# EAGLE design db9-can-hub01 (EAGLE 7.3.0)
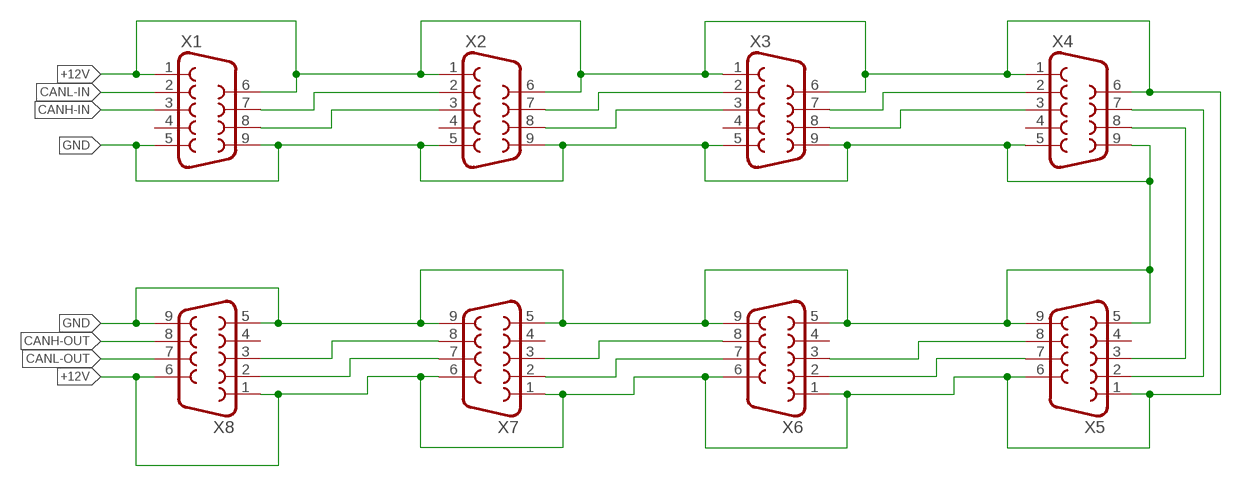
[diagram p0: schematic, sheet 1]

## Parts
X1  F09H  [F09H]
X2  F09H  [F09H]
X3  F09H  [F09H]
X4  F09H  [F09H]
X5  F09H  [F09H]
X6  F09H  [F09H]
X7  F09H  [F09H]
X8  F09H  [F09H]

## Nets
+12V: X1.1 X1.6 X2.1 X2.6 X3.1 X3.6 X4.1 X4.6 X5.1 X5.6 X6.1 X6.6 X7.1 X7.6 X8.1 X8.6
CANH-IN: X1.3
CANH-OUT: X8.8
CANL-IN: X1.2
CANL-OUT: X8.7
GND: X1.5 X1.9 X2.5 X2.9 X3.5 X3.9 X4.5 X4.9 X5.5 X5.9 X6.5 X6.9 X7.5 X7.9 X8.5 X8.9
N$1: X1.7 X2.2
N$2: X1.8 X2.3
N$3: X2.7 X3.2
N$4: X2.8 X3.3
N$5: X3.7 X4.2
N$6: X3.8 X4.3
N$7: X4.8 X5.3
N$8: X4.7 X5.2
N$9: X5.7 X6.2
N$10: X5.8 X6.3
N$11: X6.7 X7.2
N$12: X6.8 X7.3
N$13: X7.7 X8.2
N$14: X7.8 X8.3
Unconnected: X1.4 X2.4 X3.4 X4.4 X5.4 X6.4 X7.4 X8.4

## Library data of the parts
X1-X8 = con-subd:F09: SUB-D; OC_FARNELL: unknown; OC_NEWARK: unknown

## Board
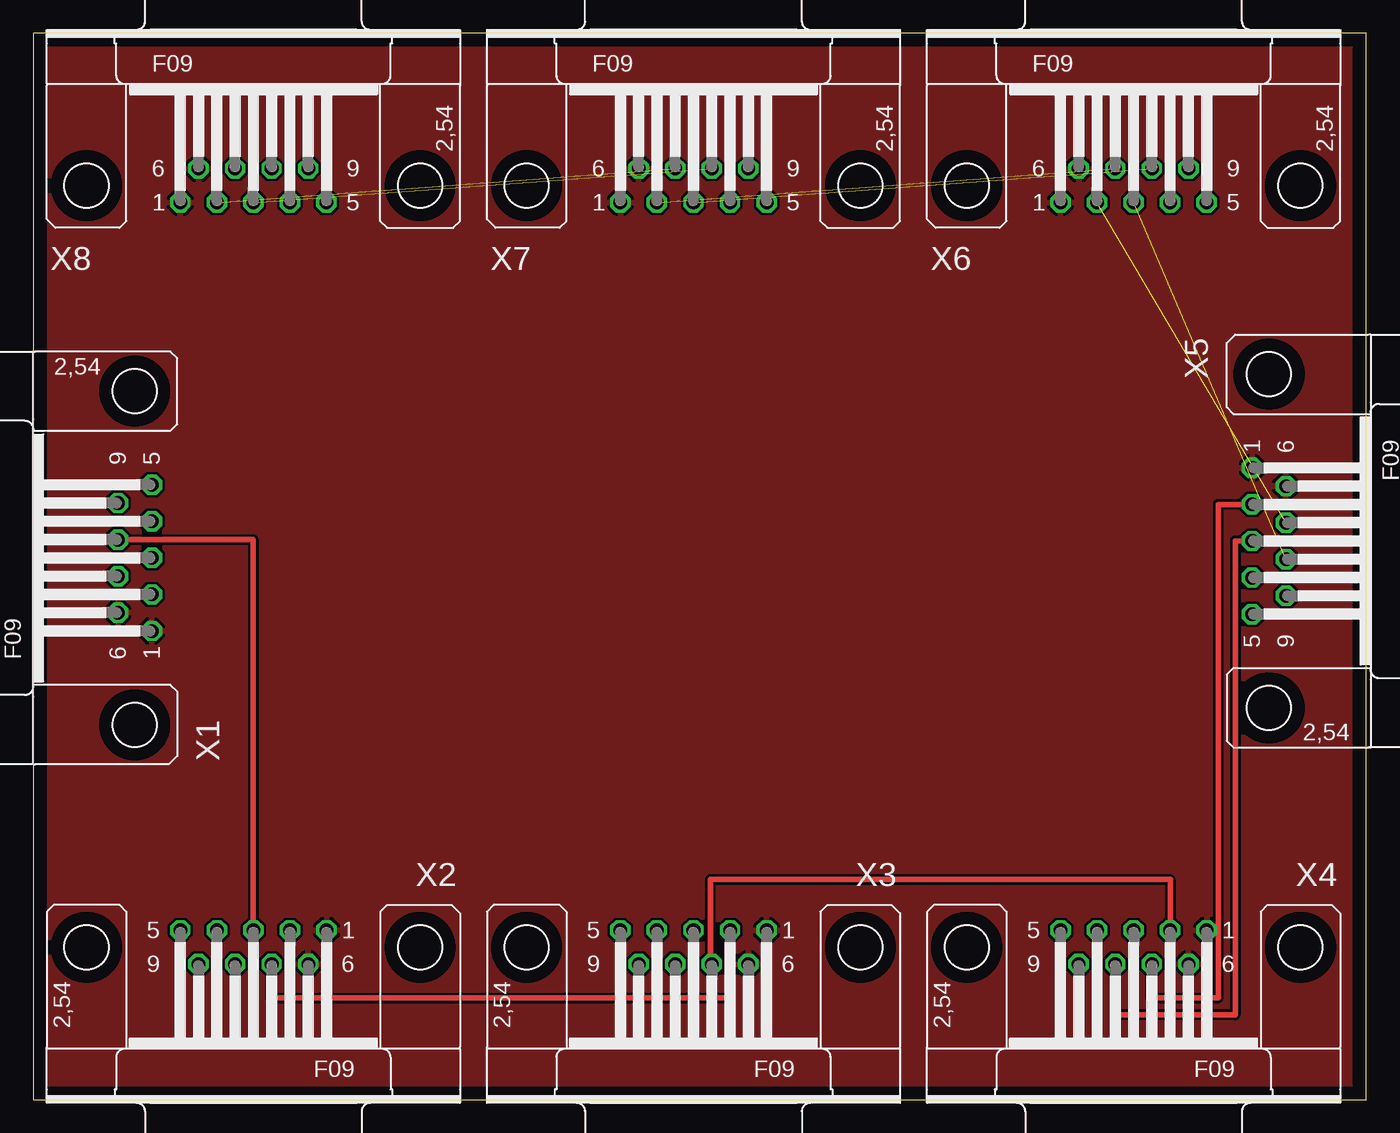
[diagram p1: board, top side]
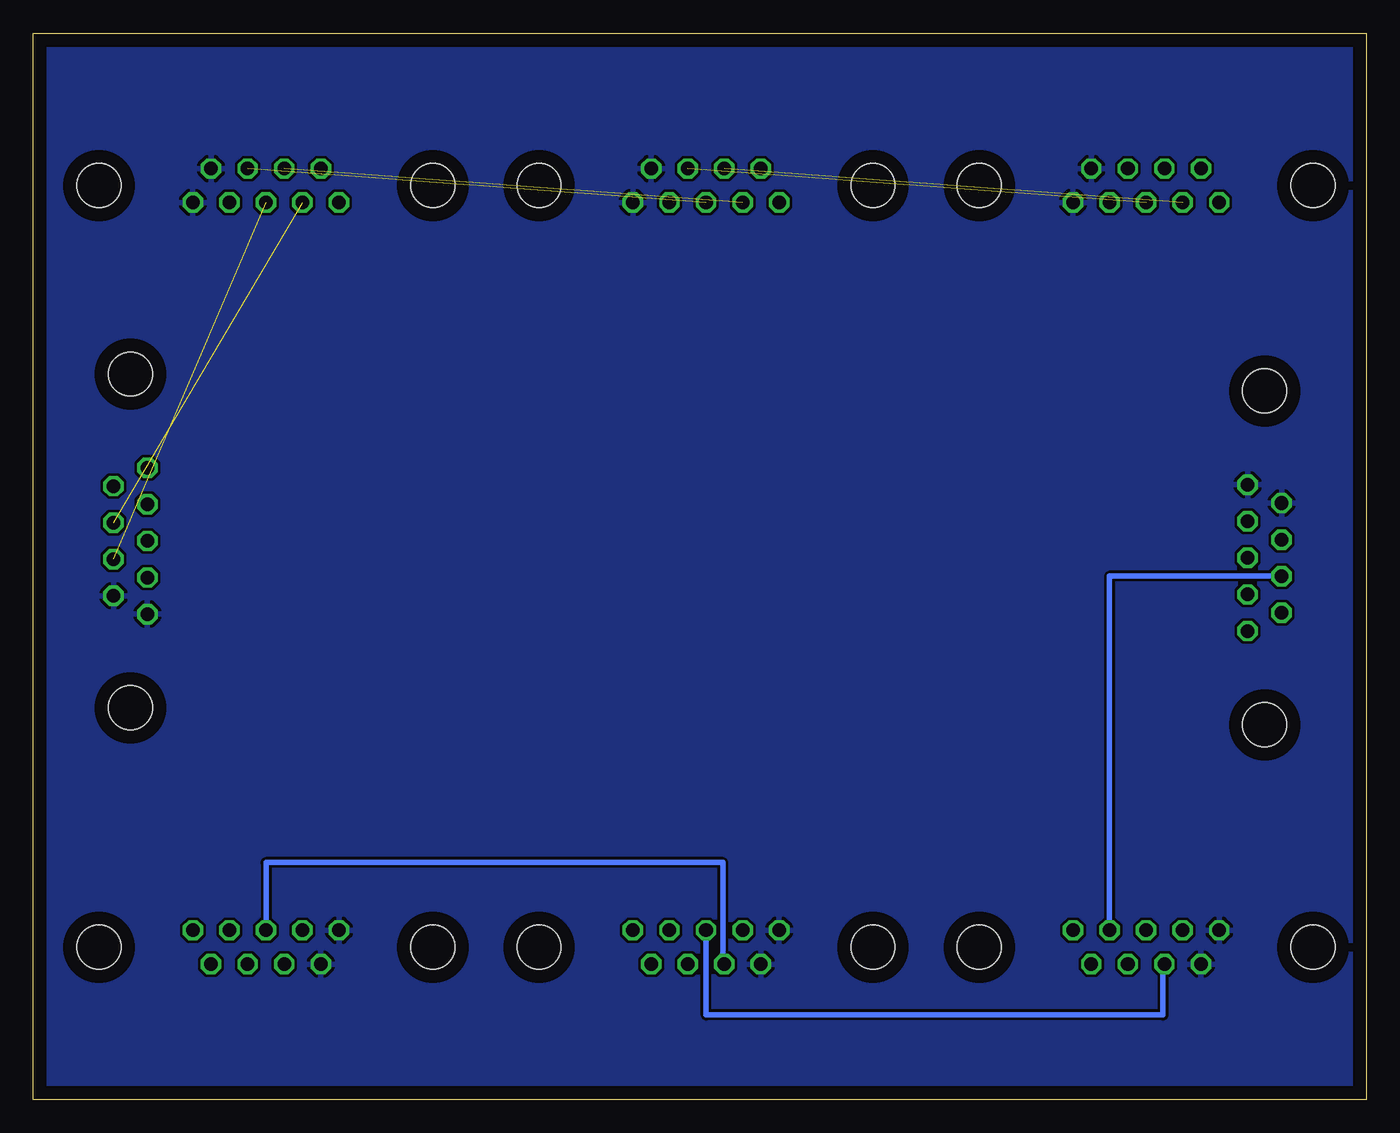
[diagram p2: board, bottom side, seen from below]

Size 100 x 80 mm. Coordinates in mm from the lower left corner, seen from the top.
Outline: 0,0 100,0 100,80 0,80 0,0
Copper layers (1*16): Top 0.035mm / dielectric 1.5mm / Bottom 0.035mm
Design rules "default": minimum track width 10mil, minimum drill 24mil, track to track 8mil, track to pad 8mil, pad to pad 8mil, via to via 8mil, smd to smd 8mil, copper to edge 40mil, drill to drill 8mil, minimum pad ring 10mil, minimum via ring 8mil, stop-mask expansion 4mil, vias tented up to drill 0mil, thermal gap 10mil

### Footprints (pad centres in the part's own frame; a part is rotated, then mirrored left to right if it is on the bottom)
F09H = drill 1.016 octagon: 1 -5.486,-1.27; 2 -2.743,-1.27; 3 0,-1.27; 4 2.743,-1.27; 5 5.486,-1.27; 6 -4.115,1.27; 7 -1.372,1.27; 8 1.372,1.27; 9 4.115,1.27 | hole 3.302: -12.522,0; 12.522,0

### Placement (x,y rotation side)
X1  7.62,40.64 90 top
X2  16.51,11.43 180 top
X3  49.53,11.43 180 top
X4  82.55,11.43 180 top
X5  92.71,41.91 270 top
X6  82.55,68.58 0 top
X7  49.53,68.58 0 top
X8  16.51,68.58 0 top

### Tracks (layer width: path | path; a pad name or v marks a point on that pad's centre or on a via)
+12V
  pour Top: 0,80.01 100.33,80.01 100.33,0 0,0
GND
  pour Bottom: 0,80.01 100.33,80.01 100.33,0 0,0
N$1
  Bottom 0.406: X1.7 19.25,39.27 X2.2
N$2
  Top 0.406: X1.8 16.51,42.01 X2.3
N$3
  Top 0.406: X2.7 17.78,10.16 17.78,7.62 52.27,7.62 X3.2
N$4
  Bottom 0.406: X2.8 15.24,10.16 15.24,6.35 49.53,6.35 X3.3
N$5
  Top 0.406: X3.7 50.8,10.16 50.8,16.51 85.29,16.51 X4.2
N$6
  Bottom 0.406: X3.8 48.26,10.16 48.26,17.78 82.55,17.78 X4.3
N$7
  Top 0.406: X5.3 90.17,41.91 90.17,6.35 81.18,6.35 X4.8
N$8
  Top 0.406: X4.7 83.82,10.16 83.82,7.62 88.9,7.62 88.9,44.65 X5.2
N$9  (1 unrouted)
N$10  (1 unrouted)
N$11  (1 unrouted)
N$12  (1 unrouted)
N$13  (1 unrouted)
N$14  (1 unrouted)